# EAGLE schematic Group6_ADC1 (EAGLE 9.6.2)
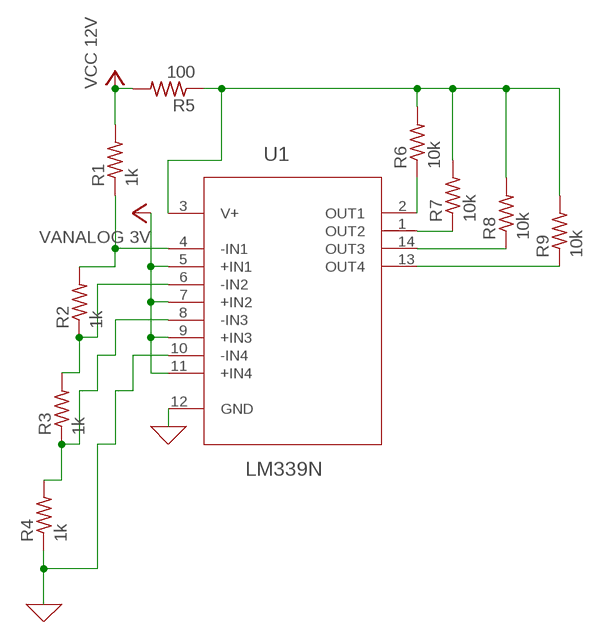
[diagram p0: schematic, sheet 1]

## Parts
R1  1k  R-US_0204/7  [0204/7]
R2  1k  R-US_0204/7  [0204/7]
R3  1k  R-US_0204/7  [0204/7]
R4  1k  R-US_0204/7  [0204/7]
R5  100  R-US_0204/7  [0204/7]
R6  10k  R-US_0204/7  [0204/7]
R7  10k  R-US_0204/7  [0204/7]
R8  10k  R-US_0204/7  [0204/7]
R9  10k  R-US_0204/7  [0204/7]
U1  LM339N  [DIP254P762X508-14]

## Nets
0: R4.1 U1.10(-IN4) U1.12(GND) ; supply symbol labelled GND
N$1: R2.1 R3.2 U1.6(-IN2)
N$2: R1.1 R2.2 U1.4(-IN1)
N$3: R3.1 R4.2 U1.8(-IN3)
N$4: R6.1 U1.2(OUT1)
N$5: R5.1 R6.2 R7.2 R8.2 R9.2 U1.3(V+)
N$6: R7.1 U1.1(OUT2)
N$7: R8.1 U1.14(OUT3)
N$8: R9.1 U1.13(OUT4)
VCC: R1.2 R5.2 U1.5(+IN1) U1.7(+IN2) U1.9(+IN3) U1.11(+IN4) ; supply symbol labelled VCC 12V, VANALOG 3V

## Library data of the parts
R1-R9 = rcl:R-US_: RESISTOR, American symbol; SPICEPREFIX: R
U1 = LM339N:LM339N: Quad Comparators Check availability <https://pricing.snapeda.com/parts/LM339N/ON%20Semiconductor/view-part?ref=eda>; AVAILABILITY: In Stock; DESCRIPTION: Comparator General Purpose CMOS, DTL, ECL, MOS, Open-Collector, TTL 14-DIP; MF: ON Semiconductor; MP: LM339N; PACKAGE: PDIP-14 ON Semiconductor; PRICE: None; PURCHASE-URL: https://pricing.snapeda.com/search/part/LM339N/?ref=eda